# EAGLE schematic Carrier Motor Driver (EAGLE 9.6.2)
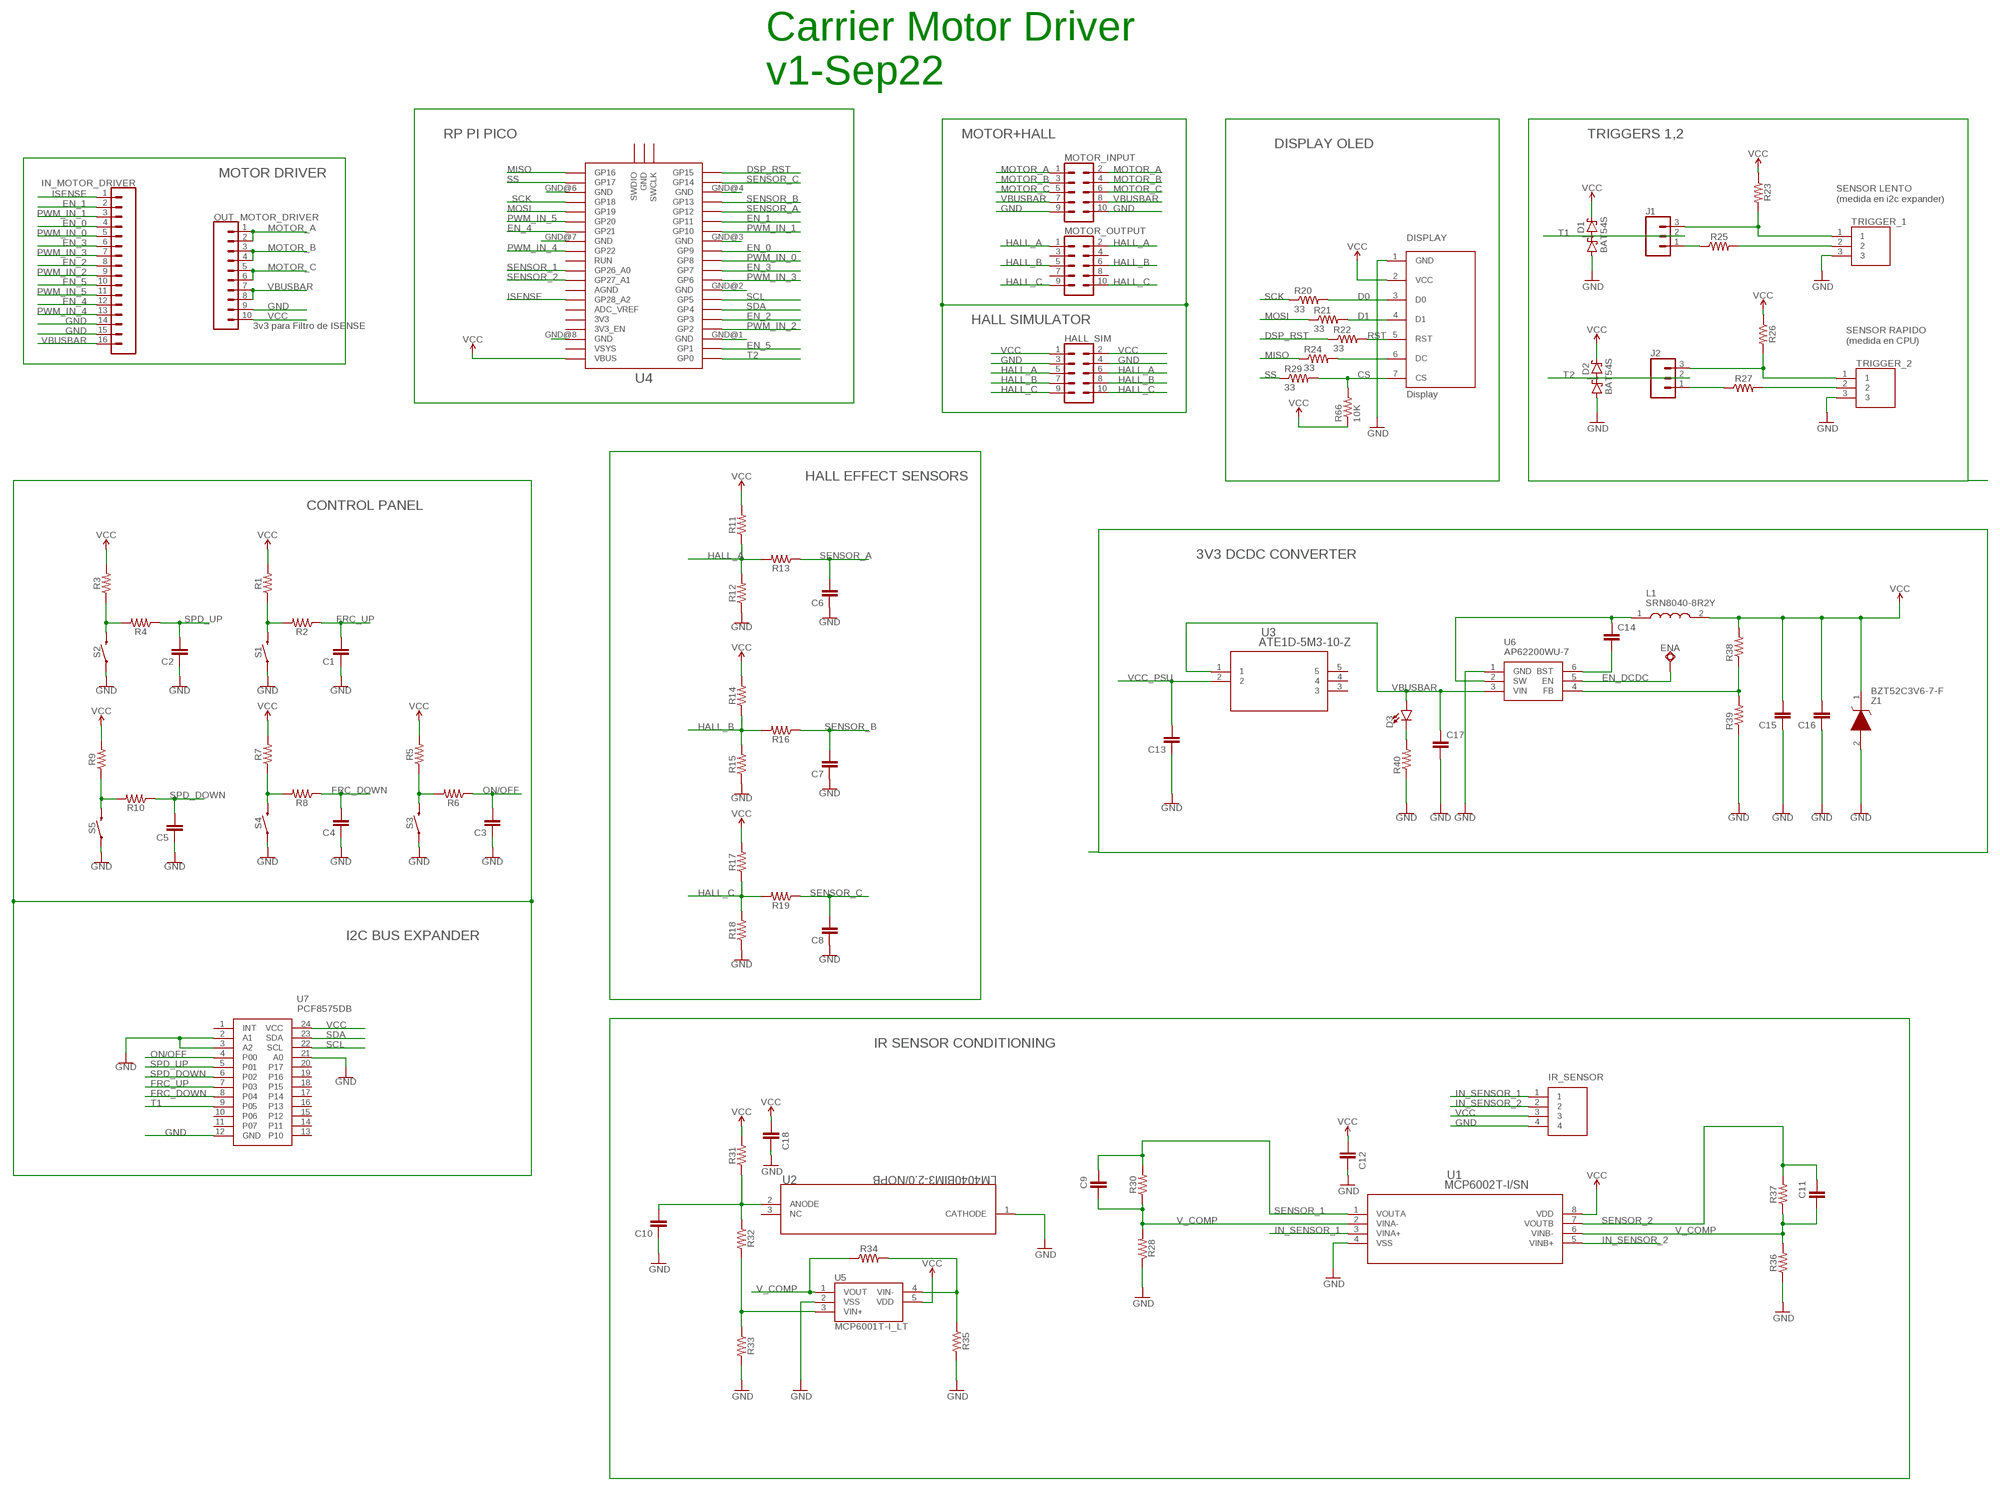
[diagram p0: schematic, sheet 1]

## Parts
C1  C-EUC0805  [C0805]
C2  C-EUC0805  [C0805]
C3  C-EUC0805  [C0805]
C4  C-EUC0805  [C0805]
C5  C-EUC0805  [C0805]
C6  C-EUC0805  [C0805]
C7  C-EUC0805  [C0805]
C8  C-EUC0805  [C0805]
C9  C-EUC0805  [C0805]
C10  C-EUC0805  [C0805]
C11  C-EUC0805  [C0805]
C12  C-EUC0805  [C0805]
C13  C-EUC0805  [C0805]
C14  C-EUC0805  [C0805]
C15  C-EUC0805  [C0805]
C16  C-EUC0805  [C0805]
C17  C-EUC0805  [C0805]
C18  C-EUC0805  [C0805]
D1  BAT54S  [SOT23]
D2  BAT54S  [SOT23]
D3  LED3MM  [LED_3MM]
DISPLAY  Display  OLED_LCD  [OLED_LCD]
ENA  TESTPAD_TPSQPAD1-17  [TESTPAD_P1-17]
HALL_SIM  CONN_05X2NO_SILK  [2X5_NOSILK]
IN_MOTOR_DRIVER  CONN_16  [1X16]
IR_SENSOR  OSTVN04A150  [OSTVN04A150]
J1  CONN_03  [1X03]
J2  CONN_03  [1X03]
L1  SRN8040-8R2Y  [SRN80408R2Y]
MOTOR_INPUT  CONN_05X2PTH  [2X5]
MOTOR_OUTPUT  CONN_05X2PTH  [2X5]
OUT_MOTOR_DRIVER  CONN_10"  [1X10]
R1  RESISTOR0805  [0805]
R2  RESISTOR0805  [0805]
R3  RESISTOR0805  [0805]
R4  RESISTOR0805  [0805]
R5  RESISTOR0805  [0805]
R6  RESISTOR0805  [0805]
R7  RESISTOR0805  [0805]
R8  RESISTOR0805  [0805]
R9  RESISTOR0805  [0805]
R10  RESISTOR0805  [0805]
R11  RESISTOR0805  [0805]
R12  RESISTOR0805  [0805]
R13  RESISTOR0805  [0805]
R14  RESISTOR0805  [0805]
R15  RESISTOR0805  [0805]
R16  RESISTOR0805  [0805]
R17  RESISTOR0805  [0805]
R18  RESISTOR0805  [0805]
R19  RESISTOR0805  [0805]
R20  33  RESISTOR0805-RES  [0805]
R21  33  RESISTOR0805-RES  [0805]
R22  33  RESISTOR0805-RES  [0805]
R23  RESISTOR0805  [0805]
R24  33  RESISTOR0805-RES  [0805]
R25  RESISTOR0805  [0805]
R26  RESISTOR0805  [0805]
R27  RESISTOR0805  [0805]
R28  RESISTOR0805  [0805]
R29  33  RESISTOR0805-RES  [0805]
R30  RESISTOR0805  [0805]
R31  RESISTOR0805  [0805]
R32  RESISTOR0805  [0805]
R33  RESISTOR0805  [0805]
R34  RESISTOR0805  [0805]
R35  RESISTOR0805  [0805]
R36  RESISTOR0805  [0805]
R37  RESISTOR0805  [0805]
R38  10K  RESISTOR0805-RES  [0805]
R39  10K  RESISTOR0805-RES  [0805]
R40  10K  RESISTOR0805-RES  [0805]
R66  10K  RESISTOR0805-RES  [0805]
S1  MOMENTARY-SWITCH-SPST-SMD-5.2MM  [TACTILE_SWITCH_SMD_5.2MM]
S2  MOMENTARY-SWITCH-SPST-SMD-5.2MM  [TACTILE_SWITCH_SMD_5.2MM]
S3  MOMENTARY-SWITCH-SPST-SMD-5.2MM  [TACTILE_SWITCH_SMD_5.2MM]
S4  MOMENTARY-SWITCH-SPST-SMD-5.2MM  [TACTILE_SWITCH_SMD_5.2MM]
S5  MOMENTARY-SWITCH-SPST-SMD-5.2MM  [TACTILE_SWITCH_SMD_5.2MM]
TRIGGER_1  OSTVN03A150  [OSTVN03A150]
TRIGGER_2  OSTVN03A150  [OSTVN03A150]
U1  MCP6002T-I/SN  [SOIC8-N_MC_MCH]
U2  LM4040BIM3-2.0/NOPB  [DBZ3]
U3  ATE1D-5M3-10-Z  [SPDT05_ATE1D_9P5X8_NDC]
U4  RPI_PICO_IG-SMD  [RPI_PICO]
U5  MCP6001T-I_LT  [SOT65P210X110-5N]
U6  AP62200WU-7  [SOT95P280X100-6N]
U7  PCF8575DB  [SOP65P780X200-24N]
Z1  BZT52C3V6-7-F  [SOD3716X135N]

## Nets
CS: DISPLAY.7(CS) R29.2 R66.2
D0: DISPLAY.3(D0) R20.2
D1: DISPLAY.4(D1) R21.2
DSP_RST: R22.1 U4.GP15
EN_0: IN_MOTOR_DRIVER.4 U4.GP9
EN_1: IN_MOTOR_DRIVER.2 U4.GP11
EN_2: IN_MOTOR_DRIVER.8 U4.GP3
EN_3: IN_MOTOR_DRIVER.6 U4.GP7
EN_4: IN_MOTOR_DRIVER.12 U4.GP21
EN_5: IN_MOTOR_DRIVER.10 U4.GP1
EN_DCDC: ENA.TP U6.5(EN)
FRC_DOWN: C4.2 R8.1 U7.8(P04)
FRC_UP: C1.2 R2.1 U7.7(P03)
GND: C1.1 C2.1 C3.1 C4.1 C5.1 C6.1 C7.1 C8.1 C10.1 C12.1 C13.1 C15.1 C16.1 C17.2 C18.1 D1.1(A1) D2.1(A1) DISPLAY.1(GND) HALL_SIM.3 HALL_SIM.4 IN_MOTOR_DRIVER.14 IN_MOTOR_DRIVER.15 IR_SENSOR.4 MOTOR_INPUT.9 MOTOR_INPUT.10 OUT_MOTOR_DRIVER.9 R12.1 R15.1 R18.1 R28.1 R33.2 R35.2 R36.1 R39.1 R40.1 S1.1 S2.1 S3.1 S4.1 S5.1 TRIGGER_1.3 TRIGGER_2.3 U1.4(VSS) U2.1(CATHODE) U4.GND@1(GND) U4.GND@2(GND) U4.GND@3(GND) U4.GND@4(GND) U4.GND@6(GND) U4.GND@7(GND) U4.GND@8(GND) U5.2(VSS) U6.1(GND) U7.2(A1) U7.3(A2) U7.12(GND) U7.21(A0) Z1.2(A)
HALL_A: HALL_SIM.5 HALL_SIM.6 MOTOR_OUTPUT.1 MOTOR_OUTPUT.2 R11.1 R12.2 R13.2
HALL_B: HALL_SIM.7 HALL_SIM.8 MOTOR_OUTPUT.5 MOTOR_OUTPUT.6 R14.1 R15.2 R16.2
HALL_C: HALL_SIM.9 HALL_SIM.10 MOTOR_OUTPUT.9 MOTOR_OUTPUT.10 R17.1 R18.2 R19.2
IN_SENSOR_1: IR_SENSOR.1 U1.3(VINA+)
IN_SENSOR_2: IR_SENSOR.2 U1.5(VINB+)
ISENSE: IN_MOTOR_DRIVER.1 U4.GP28_A2
MISO: R24.1 U4.GP16
MOSI: R21.1 U4.GP19
MOTOR_A: MOTOR_INPUT.1 MOTOR_INPUT.2 OUT_MOTOR_DRIVER.1 OUT_MOTOR_DRIVER.2
MOTOR_B: MOTOR_INPUT.3 MOTOR_INPUT.4 OUT_MOTOR_DRIVER.3 OUT_MOTOR_DRIVER.4
MOTOR_C: MOTOR_INPUT.5 MOTOR_INPUT.6 OUT_MOTOR_DRIVER.5 OUT_MOTOR_DRIVER.6
N$1: R1.1 R2.2 S1.3
N$3: R3.1 R4.2 S2.3
N$5: R5.1 R6.2 S3.3
N$6: R34.2 R35.1 U5.4(VIN-)
N$7: R7.1 R8.2 S4.3
N$8: R32.2 R33.1 U5.3(VIN+)
N$9: R9.1 R10.2 S5.3
N$10: C10.2 R31.1 R32.1 U2.2(ANODE)
N$17: DISPLAY.6(DC) R24.2
N$18: J2.3 R26.2 TRIGGER_2.1
N$19: R27.2 TRIGGER_2.2
N$21: J1.3 R23.2 TRIGGER_1.1
N$22: R25.2 TRIGGER_1.2
N$23: J2.1 R27.1
N$24: J1.1 R25.1
N$28: D3.K(C) R40.2
N$31: C14.2 U6.6(BST)
N$32: C14.1 L1.1 U6.2(SW)
N$33: R38.1 R39.2 U6.4(FB)
ON/OFF: C3.2 R6.1 U7.4(P00)
PWM_IN_0: IN_MOTOR_DRIVER.5 U4.GP8
PWM_IN_1: IN_MOTOR_DRIVER.3 U4.GP10
PWM_IN_2: IN_MOTOR_DRIVER.9 U4.GP2
PWM_IN_3: IN_MOTOR_DRIVER.7 U4.GP6
PWM_IN_4: IN_MOTOR_DRIVER.13 U4.GP22
PWM_IN_5: IN_MOTOR_DRIVER.11 U4.GP20
RST: DISPLAY.5(RST) R22.2
SCK: R20.1 U4.GP18
SCL: U4.GP5 U7.22(SCL)
SDA: U4.GP4 U7.23(SDA)
SENSOR_1: C9.1 R30.2 U1.1(VOUTA) U4.GP26_A0
SENSOR_2: C11.1 R37.2 U1.7(VOUTB) U4.GP27_A1
SENSOR_A: C6.2 R13.1 U4.GP12
SENSOR_B: C7.2 R16.1 U4.GP13
SENSOR_C: C8.2 R19.1 U4.GP14
SPD_DOWN: C5.2 R10.1 U7.6(P02)
SPD_UP: C2.2 R4.1 U7.5(P01)
SS: R29.1 U4.GP17
T1: D1.3(C1A2) J1.2 U7.9(P05)
T2: D2.3(C1A2) J2.2 U4.GP0
V_COMP: C9.2 C11.2 R28.2 R30.1 R34.1 R36.2 R37.1 U1.2(VINA-) U1.6(VINB-) U5.1(VOUT)
VBUSBAR: C17.1 D3.A IN_MOTOR_DRIVER.16 MOTOR_INPUT.7 MOTOR_INPUT.8 OUT_MOTOR_DRIVER.7 OUT_MOTOR_DRIVER.8 U3.1 U6.3(VIN)
VCC: C12.2 C15.2 C16.2 C18.2 D1.2(C2) D2.2(C2) DISPLAY.2(VCC) HALL_SIM.1 HALL_SIM.2 IR_SENSOR.3 L1.2 OUT_MOTOR_DRIVER.10 R1.2 R3.2 R5.2 R7.2 R9.2 R11.2 R14.2 R17.2 R23.1 R26.1 R31.2 R38.2 R66.1 U1.8(VDD) U4.VBUS U5.5(VDD) U7.24(VCC) Z1.1(K)
VCC_PSU: C13.2 U3.2
Unconnected: MOTOR_OUTPUT.3 MOTOR_OUTPUT.4 MOTOR_OUTPUT.7 MOTOR_OUTPUT.8 U2.3(NC) U3.3 U3.4 U3.5 U4.3V3 U4.3V3_EN U4.ADC_VREF U4.AGND U4.GND@5(GND) U4.RUN U4.SWCLK U4.SWDIO U4.VSYS U7.1(INT) U7.10(P06) U7.11(P07) U7.13(P10) U7.14(P11) U7.15(P12) U7.16(P13) U7.17(P14) U7.18(P15) U7.19(P16) U7.20(P17)

## Notes on the sheet
- Carrier Motor Driver
  v1-Sep22
- RP PI PICO | MOTOR+HALL | TRIGGERS 1,2
- DISPLAY OLED
- MOTOR DRIVER
- SENSOR LENTO
  (medida en i2c expander)
- HALL SIMULATOR
- 3v3 para Filtro de ISENSE
- SENSOR RAPIDO
  (medida en CPU)
- HALL EFFECT SENSORS
- CONTROL PANEL
- 3V3 DCDC CONVERTER
- I2C BUS EXPANDER
- IR SENSOR CONDITIONING

## Library data of the parts
C1-C18 = rcl:C-EU: CAPACITOR, European symbol; SPICEPREFIX: C
D1 D2 = diode:BAT54S: Schottky Diodes Pin connection corrected 2011-05-04 Source: Fairchild .. BAT54.pdf
D3 = SparkFun-LED:LED: LED (Generic) Standard schematic elements and footprints for 5mm, 3mm, 1206, and 0603 sized LEDs. Generic LEDs with no color specified.; PROD_ID: DIO-08794
DISPLAY = EDCPSU:OLED_LCD
ENA = BeagleBone_Blue_R3:TESTPAD_TPSQ: Test pad
HALL_SIM = SparkFun-Connectors:CONN_05X2: Multi connection point. Often used as Generic Header-pin footprint for 0.1 inch spaced/style header connections For AVR SPI programming port, see special device with nice symbol: "AVR_SPI_PROG_5x2.dev" You can populate with any combo of single row headers, but if you'd like an exact match, check these: 2x5 AVR ICSP Male Header <https://www.sparkfun.com/products/778> (PRT-00778) 2x5 Pin Shrouded Header <https://www.sparkfun.com/products/8506> (PRT-08506) On any of the 0.1 inch spaced packages, you can populate with these: Break Away Headers - Straight <https://www.sparkfun.com/products/116> (PRT-00116) Break Away Male Headers - Right Angle <https://www.sparkfun.com/products/553> (PRT-00553) Female Headers <https://www.sparkfun.com/products/115> (PRT-00115) Break Away Headers - Machine Pin <https://www.sparkfun.com/products/117> (PRT-00117) Break Away Female Headers - Swiss Machine Pin <https://www.sparkfun.com/products/743> (PRT-00743) Special note: the shrouded connector mates well with our 5x2 ribbon cables: 2x5 Pin IDC Ribbon Cable <https://www.sparkfun.com/products/8535> (PRT-08535)
IN_MOTOR_DRIVER = SparkFun-Connectors:CONN_16: Multi connection point. Often used as Generic Header-pin footprint for 0.1 inch spaced/style header connections On any of the 0.1 inch spaced packages, you can populate with these: Break Away Headers - Straight <https://www.sparkfun.com/products/116> (PRT-00116) Break Away Male Headers - Right Angle <https://www.sparkfun.com/products/553> (PRT-00553) Female Headers <https://www.sparkfun.com/products/115> (PRT-00115) Break Away Headers - Machine Pin <https://www.sparkfun.com/products/117> (PRT-00117) Break Away Female Headers - Swiss Machine Pin <https://www.sparkfun.com/products/743> (PRT-00743) For SCREWTERMINALS and SPRING TERMINALS visit here: Screw Terimnals on SparkFun.com <https://www.sparkfun.com/search/results?term=Screw+Terminals> (5mm/3.5mm/2.54mm spacing) This device is also useful as a general connection point to wire up your design to another part of your project. Our various solder wires solder well into these plated through hole pads. Hook-Up Wire - Assortment (Stranded, 22 AWG) <https://www.sparkfun.com/products/11375> (PRT-11375) Hook-Up Wire - Assortment (Solid Core, 22 AWG) <https://www.sparkfun.com/products/11367> (PRT-11367) View the entire wire category on our website here <https://www.sparkfun.com/categories/141> Special notes: Molex polarized connector foot print use with SKU : PRT-08231 with associated crimp pins and housings. 1MM SMD Version SKU: PRT-10208 NOTES ON THE VARIANTS LOCK and LOCK_LONGPADS... This footprint was designed to help hold the alignment of a through-hole component (i.e. 6-pin header) while soldering it into place. You may notice that each hole has been shifted either up or down by 0.005 of an inch from it's more standard position (which is a perfectly straight line). This slight alteration caused the pins (the squares in the middle) to touch the edges of the holes. Because they are alternating, it causes a "brace" to hold the component in place. 0.005 has proven to be the perfect amount of "off-center" position when using our standard breakaway headers. Although looks a little odd when you look at the bare footprint, once you have a header in there, the alteration is very hard to notice. Also,if you push a header all the way into place, it is covered up entirely on the bottom side.
IR_SENSOR = OSTVN04A150:OSTVN04A150: Conn Terminal Block 4 POS 2.54mm Solder ST Thru-Hole 6A Source: Datasheet <https://datasheet.datasheetarchive.com/originals/dk/DKDS-18/336816.pdf>; ARROW_PART_NUMBER: OSTVN04A150; ARROW_PRICE-STOCK: https://www.arrow.com/en/products/ostvn04a150/on-shore-technology?region=nac; DESCRIPTION: Conn Terminal Block 4 POS 2.54mm Solder ST Thru-Hole 6A; HEIGHT: 8.8mm; MANUFACTURER_NAME: On-Shore Technology, Inc; MANUFACTURER_PART_NUMBER: OSTVN04A150
J1 J2 = SparkFun-Connectors:CONN_03: Multi connection point. Often used as Generic Header-pin footprint for 0.1 inch spaced/style header connections On any of the 0.1 inch spaced packages, you can populate with these: Break Away Headers - Straight <https://www.sparkfun.com/products/116> (PRT-00116) Break Away Male Headers - Right Angle <https://www.sparkfun.com/products/553> (PRT-00553) Female Headers <https://www.sparkfun.com/products/115> (PRT-00115) Break Away Headers - Machine Pin <https://www.sparkfun.com/products/117> (PRT-00117) Break Away Female Headers - Swiss Machine Pin <https://www.sparkfun.com/products/743> (PRT-00743) Stackable Header - 3 Pin (Female, 0.1") <https://www.sparkfun.com/products/13875> (PRT-13875) For SCREWTERMINALS and SPRING TERMINALS visit here: Screw Terimnals on SparkFun.com <https://www.sparkfun.com/search/results?term=Screw+Terminals> (5mm/3.5mm/2.54mm spacing) This device is also useful as a general connection point to wire up your design to another part of your project. Our various solder wires solder well into these plated through hole pads. Hook-Up Wire - Assortment (Stranded, 22 AWG) <https://www.sparkfun.com/products/11375> (PRT-11375) Hook-Up Wire - Assortment (Solid Core, 22 AWG) <https://www.sparkfun.com/products/11367> (PRT-11367) View the entire wire category on our website here <https://www.sparkfun.com/categories/141> Special notes: Molex polarized connector foot print use with SKU : PRT-08232 with associated crimp pins and housings.
L1 = SRN8040-8R2Y:SRN8040-8R2Y: Bourns, SRN8040, 8040 Shielded Wire-wound SMD Inductor with a Ferrite Core, 8.2 uH +/-30% Wire-Wound 4A Idc Source: Datasheet <https://www.bourns.com/docs/Product-Datasheets/SRN8040.pdf>; ARROW_PART_NUMBER: SRN8040-8R2Y; ARROW_PRICE-STOCK: https://www.arrow.com/en/products/srn8040-8r2y/bourns; DESCRIPTION: Bourns, SRN8040, 8040 Shielded Wire-wound SMD Inductor with a Ferrite Core, 8.2 uH +/-30% Wire-Wound 4A Idc; HEIGHT: 4mm; MANUFACTURER_NAME: Bourns; MANUFACTURER_PART_NUMBER: SRN8040-8R2Y; MOUSER_PART_NUMBER: 652-SRN8040-8R2Y; MOUSER_PRICE-STOCK: https://www.mouser.co.uk/ProductDetail/Bourns/SRN8040-8R2Y?qs=opBjA1TV903pPxFXaQmF%2Fw%3D%3D
MOTOR_INPUT MOTOR_OUTPUT = SparkFun-Connectors:CONN_05X2: Multi connection point. Often used as Generic Header-pin footprint for 0.1 inch spaced/style header connections For AVR SPI programming port, see special device with nice symbol: "AVR_SPI_PROG_5x2.dev" You can populate with any combo of single row headers, but if you'd like an exact match, check these: 2x5 AVR ICSP Male Header <https://www.sparkfun.com/products/778> (PRT-00778) 2x5 Pin Shrouded Header <https://www.sparkfun.com/products/8506> (PRT-08506) On any of the 0.1 inch spaced packages, you can populate with these: Break Away Headers - Straight <https://www.sparkfun.com/products/116> (PRT-00116) Break Away Male Headers - Right Angle <https://www.sparkfun.com/products/553> (PRT-00553) Female Headers <https://www.sparkfun.com/products/115> (PRT-00115) Break Away Headers - Machine Pin <https://www.sparkfun.com/products/117> (PRT-00117) Break Away Female Headers - Swiss Machine Pin <https://www.sparkfun.com/products/743> (PRT-00743) Special note: the shrouded connector mates well with our 5x2 ribbon cables: 2x5 Pin IDC Ribbon Cable <https://www.sparkfun.com/products/8535> (PRT-08535); PROD_ID: CONN-08499; SF_ID: PRT-0778
OUT_MOTOR_DRIVER = SparkFun-Connectors:CONN_10: Multi connection point. Often used as Generic Header-pin footprint for 0.1 inch spaced/style header connections On any of the 0.1 inch spaced packages, you can populate with these: Break Away Headers - Straight <https://www.sparkfun.com/products/116> (PRT-00116) Break Away Male Headers - Right Angle <https://www.sparkfun.com/products/553> (PRT-00553) Female Headers <https://www.sparkfun.com/products/115> (PRT-00115) Break Away Headers - Machine Pin <https://www.sparkfun.com/products/117> (PRT-00117) Break Away Female Headers - Swiss Machine Pin <https://www.sparkfun.com/products/743> (PRT-00743) Arduino Stackable Header - 10 Pin <https://www.sparkfun.com/products/11376> (PRT-11376) For SCREWTERMINALS and SPRING TERMINALS visit here: Screw Terimnals on SparkFun.com <https://www.sparkfun.com/search/results?term=Screw+Terminals> (5mm/3.5mm/2.54mm spacing) This device is also useful as a general connection point to wire up your design to another part of your project. Our various solder wires solder well into these plated through hole pads. Hook-Up Wire - Assortment (Stranded, 22 AWG) <https://www.sparkfun.com/products/11375> (PRT-11375) Hook-Up Wire - Assortment (Solid Core, 22 AWG) <https://www.sparkfun.com/products/11367> (PRT-11367) View the entire wire category on our website here <https://www.sparkfun.com/categories/141> Special notes: Molex polarized connector foot print use with SKU : PRT-08231 with associated crimp pins and housings. 1MM SMD Version SKU: PRT-10208 NOTES ON THE VARIANTS LOCK and LOCK_LONGPADS... This footprint was designed to help hold the alignment of a through-hole component (i.e. 6-pin header) while soldering it into place. You may notice that each hole has been shifted either up or down by 0.005 of an inch from it's more standard position (which is a perfectly straight line). This slight alteration caused the pins (the squares in the middle) to touch the edges of the holes. Because they are alternating, it causes a "brace" to hold the component in place. 0.005 has proven to be the perfect amount of "off-center" position when using our standard breakaway headers. Although looks a little odd when you look at the bare footprint, once you have a header in there, the alteration is very hard to notice. Also,if you push a header all the way into place, it is covered up entirely on the bottom side.; PROD_ID: CONN-11563
R1-R19 R23 R25-R28 R30-R37 = SparkFun-Resistors:RESISTOR: Generic Resistor Package
R20-R22 R24 R29 R38-R40 R66 = SparkFun:RESISTOR: Resistor Basic schematic elements and footprints for 0603, 1206, and PTH resistors.
S1-S5 = SparkFun-Switches:MOMENTARY-SWITCH-SPST: Momentary Switch (Pushbutton) - SPST Normally-open (NO) SPST momentary switches (buttons, pushbuttons). Variants PTH-12MM - 12mm square, through-hole Momentary Pushbutton Switch - 12mm Square <https://www.sparkfun.com/products/9190> (COM-09190) PTH-6.0MM, PTH-6.0MM-KIT - 6.0mm square, through-hole Mini Pushbutton Switch <https://www.sparkfun.com/products/97> (COM-00097) KIT package intended for soldering kit's - only one side of pads' copper is exposed. PTH-RIGHT-ANGLE-KIT - Right-angle, through-hole Right Angle Tactile Button <https://www.sparkfun.com/products/10791> - Used on SparkFun BigTime Watch Kit <https://www.sparkfun.com/products/11734> SMD-12MM - 12mm square, surface-mount Tactile Button - SMD (12mm) <https://www.sparkfun.com/products/12993> (COM-12993) Used on SparkFun PicoBoard <https://www.sparkfun.com/products/11888> SMD-4.5MM - 4.5mm Square Trackball Switch Used on SparkFun Blackberry Trackballer Breakout <https://www.sparkfun.com/products/13169> SMD-4.6MMX2.8MM - 4.60mm x 2.80mm, surface mount Used on SparkFun SAMD21 Mini Breakout <https://www.sparkfun.com/products/13664> SMD-5.2MM, SMD-5.2-REDUNDANT - 5.2mm square, surface-mount Mini Pushbutton Switch - SMD <https://www.sparkfun.com/products/8720> (COM-08720) Used on Arduino Pro Mini <https://www.sparkfun.com/products/11114> REDUNDANT package connects both switch circuits together SMD-6.0X3.5MM - 6.0 x 3.5mm, surface mount Momentary Reset Switch SMD <https://www.sparkfun.com/products/8229> (COM-08229) SMD-6.2MM-TALL - 6.2mm square, surface mount Tactile Button - SMD (6mm) <https://www.sparkfun.com/products/12992> Used on SparkFun Digital Sandbox <https://www.sparkfun.com/products/12651> SMD-RIGHT-ANGLE - Right-angle, surface mount Used on SparkFun Block for Intel® Edison - Arduino <https://www.sparkfun.com/products/13036>; PROD_ID: SWCH-08247; SF_SKU: COM-08720
TRIGGER_1 TRIGGER_2 = OSTVN03A150:OSTVN03A150: OSTVN03A150 Source: Datasheet <https://www.on-shore.com/wp-content/uploads/OSTVNXXA150.pdf>; ARROW_PART_NUMBER: OSTVN03A150; ARROW_PRICE-STOCK: https://www.arrow.com/en/products/ostvn03a150/on-shore-technology; DESCRIPTION: OSTVN03A150; HEIGHT: 8.8mm; MANUFACTURER_NAME: On-Shore Technology, Inc; MANUFACTURER_PART_NUMBER: OSTVN03A150
U1 = MCP6002T:MCP6002T-I/SN; COPYRIGHT: Copyright (C) 2022 Ultra Librarian. All rights reserved.; DIGI-KEY_PART_NUMBER_1: MCP6002T-I/SNCT-ND; DIGI-KEY_PART_NUMBER_2: MCP6002T-I/SNDKR-ND; DIGI-KEY_PART_NUMBER_3: MCP6002T-I/SNTR-ND; MANUFACTURER_PART_NUMBER: MCP6002T-I/SN; MFR_NAME: Microchip
U2 = lm4040:LM4040BIM3-2.0/NOPB; DATASHEET_URL: http://www.ti.com/lit/gpn/LM4040D50; DESCRIPTION: 5-V Precision Micropower Shunt Voltage Reference, 1% accuracy; FAMILY_NAME: SHUNT VOLTAGE REFERENCE; GENERIC_PART_NUMBER: LM4040D50; INDUSTRY_STD_PKG_TYPE: SOT-23; MANUFACTURER: Texas Instruments; MANUFACTURER_PART_NUMBER: LM4040BIM3-2.0/NOPB; PACKAGE_DESIGNATOR: DBZ; PIN_COUNT: 3; VENDOR: Texas Instruments
U3 = ATE1D-5M3-10-Z:ATE1D-5M3-10-Z; COPYRIGHT: Copyright (C) 2022 Ultra Librarian. All rights reserved.; DIGI-KEY_PART_NUMBER_1: 563-1158-ND; MANUFACTURER_PART_NUMBER: ATE1D-5M3-10-Z; MFR_NAME: Nidec Copal Electronics
U4 = RaspberryPi_Pico:RPI_PICO_IG
U5 = MCP6001T-I_LT:MCP6001T-I_LT: Microchip MCP6001T-I/LT Low Power Op Amp, 1MHz Rail-Rail, 1.8 6 V, 5-Pin SC-70 Source: Datasheet <http://componentsearchengine.com/Datasheets/3/MCP6001T-I_LT.pdf>; ARROW_PART_NUMBER: MCP6001T-I/LT; ARROW_PRICE-STOCK: https://www.arrow.com/en/products/mcp6001t-ilt/microchip-technology?region=nac; DESCRIPTION: Microchip MCP6001T-I/LT Low Power Op Amp, 1MHz Rail-Rail, 1.8 6 V, 5-Pin SC-70; HEIGHT: 1.1mm; MANUFACTURER_NAME: Microchip; MANUFACTURER_PART_NUMBER: MCP6001T-I/LT; MOUSER_PART_NUMBER: 579-MCP6001T-I/LT; MOUSER_PRICE-STOCK: https://www.mouser.co.uk/ProductDetail/Microchip-Technology-Atmel/MCP6001T-I-LT?qs=Q%2Fw7XRh99il03y7Zr5Ze0Q%3D%3D
U6 = AP62200WU-7:AP62200WU-7: Switching Voltage Regulators DCDC Conv HV Buck TSOT26 T&R 3K Source: Datasheet <https://datasheet.datasheetarchive.com/originals/distributors/Datasheets_SAMA/8773719cd56c9c8fb48ffd720a0376ce.pdf>; ARROW_PART_NUMBER: AP62200WU-7; ARROW_PRICE-STOCK: https://www.arrow.com/en/products/ap62200wu-7/diodes-incorporated?region=nac; DESCRIPTION: Switching Voltage Regulators DCDC Conv HV Buck TSOT26 T&R 3K; HEIGHT: 1mm; MANUFACTURER_NAME: Diodes Inc.; MANUFACTURER_PART_NUMBER: AP62200WU-7; MOUSER_PART_NUMBER: 621-AP62200WU-7; MOUSER_PRICE-STOCK: https://www.mouser.co.uk/ProductDetail/Diodes-Incorporated/AP62200WU-7?qs=P1JMDcb91o6Lrrt3Idazjw%3D%3D
U7 = PCF8575DB:PCF8575DB: Interface - I/O Expanders Remote 16B I2C and SMBus I/O Expander Source: Datasheet <https://www.arrow.com/en/products/pcf8575db/texas-instruments>; ARROW_PART_NUMBER: PCF8575DB; ARROW_PRICE-STOCK: https://www.arrow.com/en/products/pcf8575db/texas-instruments?region=nac; DESCRIPTION: Interface - I/O Expanders Remote 16B I2C and SMBus I/O Expander; HEIGHT: 2mm; MANUFACTURER_NAME: Texas Instruments; MANUFACTURER_PART_NUMBER: PCF8575DB; MOUSER_PART_NUMBER: 595-PCF8575DB; MOUSER_PRICE-STOCK: https://www.mouser.co.uk/ProductDetail/Texas-Instruments/PCF8575DB?qs=fJz2RDGtR42Mo54dhvfjsQ%3D%3D
Z1 = BZT52C3V6-7-F:BZT52C3V6-7-F: Diodes Inc BZT52C3V6-7-F Zener Diode, 3.6V 6% 500 mW SMT 2-Pin SOD-123 Source: Datasheet <https://www.diodes.com/assets/Datasheets/ds18004.pdf>; ARROW_PART_NUMBER: BZT52C3V6-7-F; ARROW_PRICE-STOCK: https://www.arrow.com/en/products/bzt52c3v6-7-f/diodes-incorporated?region=nac; DESCRIPTION: Diodes Inc BZT52C3V6-7-F Zener Diode, 3.6V 6% 500 mW SMT 2-Pin SOD-123; HEIGHT: 1.35mm; MANUFACTURER_NAME: Diodes Inc.; MANUFACTURER_PART_NUMBER: BZT52C3V6-7-F; MOUSER_PART_NUMBER: 621-BZT52C3V6-F; MOUSER_PRICE-STOCK: https://www.mouser.co.uk/ProductDetail/Diodes-Incorporated/BZT52C3V6-7-F?qs=We1mx2pNWM9dxcfB67aIQA%3D%3D